# EasyEDA Pro project goobeywoobey.epro

# Schematic Schematic1
Board Name: Board1; Create Date: 2026-07-05; Page Name: P1; Project Name: falloutgpu; Schematic Name: Schematic1; Update Date: 2026-07-05; Company: EasyEDA.com; Page Size: A4; Version: V1.0
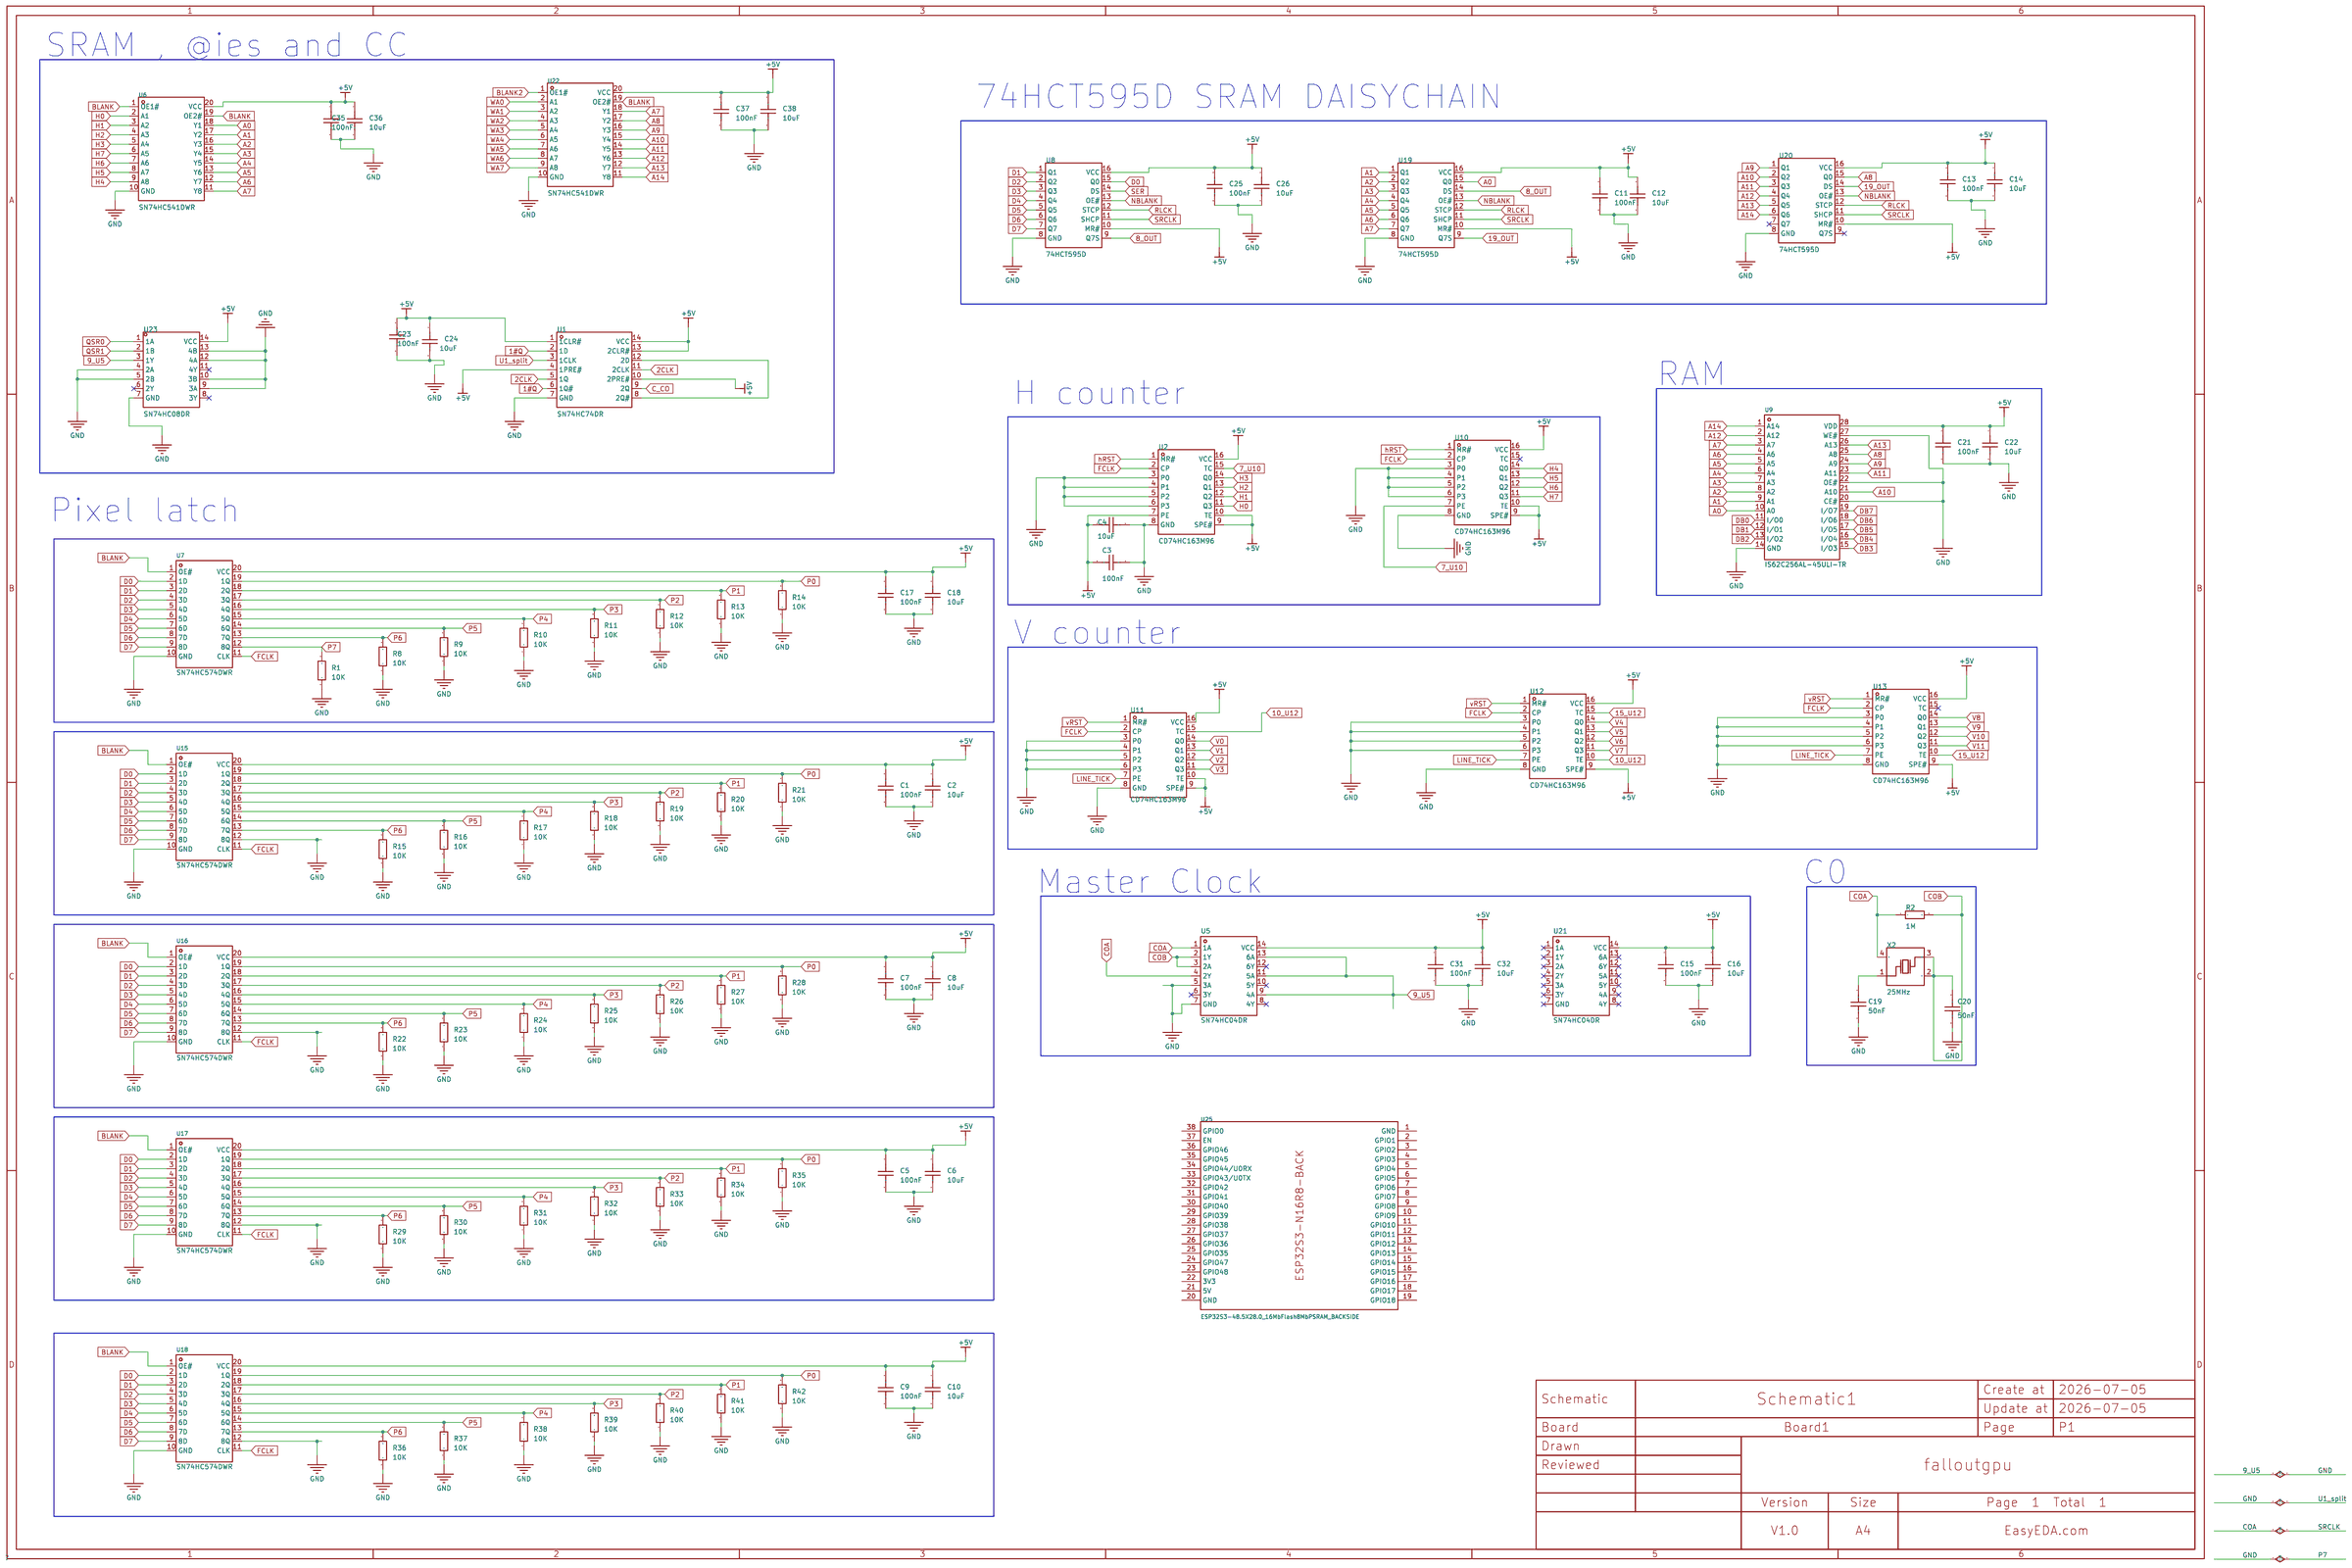
[diagram p0: schematic sheet]

## Parts
C1  100nF  [C0201]
C2  10uF  [C0201]
C3  100nF  [C0201]
C4  10uF  [C0201]
C5  100nF  [C0201]
C6  10uF  [C0201]
C7  100nF  [C0201]
C8  10uF  [C0201]
C9  100nF  [C0201]
C10  10uF  [C0201]
C11  100nF  [C0201]
C12  10uF  [C0201]
C13  100nF  [C0201]
C14  10uF  [C0201]
C15  100nF  [C0201]
C16  10uF  [C0201]
C17  100nF  [C0201]
C18  10uF  [C0201]
C19  50nF  [C0201]
C20  50nF  [C0201]
C21  100nF  [C0201]
C22  10uF  [C0201]
C23  100nF  [C0201]
C24  10uF  [C0201]
C25  100nF  [C0201]
C26  10uF  [C0201]
C31  100nF  [C0201]
C32  10uF  [C0201]
C35  100nF  [C0201]
C36  10uF  [C0201]
C37  100nF  [C0201]
C38  10uF  [C0201]
R1  10K  [R0603]
R2  1M  [R0603]
R8  10K  [R0603]
R9  10K  [R0603]
R10  10K  [R0603]
R11  10K  [R0603]
R12  10K  [R0603]
R13  10K  [R0603]
R14  10K  [R0603]
R15  10K  [R0603]
R16  10K  [R0603]
R17  10K  [R0603]
R18  10K  [R0603]
R19  10K  [R0603]
R20  10K  [R0603]
R21  10K  [R0603]
R22  10K  [R0603]
R23  10K  [R0603]
R24  10K  [R0603]
R25  10K  [R0603]
R26  10K  [R0603]
R27  10K  [R0603]
R28  10K  [R0603]
R29  10K  [R0603]
R30  10K  [R0603]
R31  10K  [R0603]
R32  10K  [R0603]
R33  10K  [R0603]
R34  10K  [R0603]
R35  10K  [R0603]
R36  10K  [R0603]
R37  10K  [R0603]
R38  10K  [R0603]
R39  10K  [R0603]
R40  10K  [R0603]
R41  10K  [R0603]
R42  10K  [R0603]
U1  SN74HC74DR  [SOIC-14_L8.7-W3.9-P1.27-LS6.0-BL]
U2  CD74HC163M96  [SOIC-16_L9.9-W3.9-P1.27-LS6.0-BL]
U5  SN74HC04DR  [SOIC-14_L8.7-W3.9-P1.27-LS6.0-BL]
U6  SN74HC541DWR  [SOIC-20_L13.0-W7.6-P1.27-LS10.3-BL]
U7  SN74HC574DWR  [SOIC-20_L13.0-W7.6-P1.27-LS10.3-BL]
U8  74HCT595D  [SOP-16_L9.9-W3.9-P1.27-LS6.0-BL]
U9  IS62C256AL-45ULI-TR  [SOIC-28_L17.9-W8.4-P1.27-LS12.7-BL]
U10  CD74HC163M96  [SOIC-16_L9.9-W3.9-P1.27-LS6.0-BL]
U11  CD74HC163M96  [SOIC-16_L9.9-W3.9-P1.27-LS6.0-BL]
U12  CD74HC163M96  [SOIC-16_L9.9-W3.9-P1.27-LS6.0-BL]
U13  CD74HC163M96  [SOIC-16_L9.9-W3.9-P1.27-LS6.0-BL]
U15  SN74HC574DWR  [SOIC-20_L13.0-W7.6-P1.27-LS10.3-BL]
U16  SN74HC574DWR  [SOIC-20_L13.0-W7.6-P1.27-LS10.3-BL]
U17  SN74HC574DWR  [SOIC-20_L13.0-W7.6-P1.27-LS10.3-BL]
U18  SN74HC574DWR  [SOIC-20_L13.0-W7.6-P1.27-LS10.3-BL]
U19  74HCT595D  [SOP-16_L9.9-W3.9-P1.27-LS6.0-BL]
U20  74HCT595D  [SOP-16_L9.9-W3.9-P1.27-LS6.0-BL]
U21  SN74HC04DR  [SOIC-14_L8.7-W3.9-P1.27-LS6.0-BL]
U22  SN74HC541DWR  [SOIC-20_L13.0-W7.6-P1.27-LS10.3-BL]
U23  SN74HC08DR  [SOIC-14_L8.7-W3.9-P1.27-LS6.0-BL]
U25  ESP32S3-48.5X28.0_16MbFlash8MbPSRAM_BACKSIDE  [ESP32S3-N16R8-BACKSIDE]
X2  25MHz  [CRYSTAL-SMD_4P-L3.2-W2.5-BL-2]

## Library data of the parts
C1-C26 C31 C32 C35-C38 = CAP_0201: Supplier Footprint: 0201
R1 R2 R8-R42 = Res_0603: Supplier Footprint: 0603
U1 = SN74HC74DR: Type:D-Type Trigger Type:Rising Edge Voltage - Supply:2V~6V Voltage - Supply:2V~6V Clock Frequency:60MHz Function:Set and Reset Number of Elements:2 Number of Bits per Element:1 Output Type:Complementary Propagation Delay:15ns@6V,50pF Series:74HC Series C; LCSC Part Name: 双D型正边沿触发触发器，带清零和预置功能，工作电压范围2V至6V; Supplier Part: C6762; Manufacturer: TI(德州仪器); Supplier Footprint: SOIC-14; JLCPCB Part Class: Extended Part; Datasheet: https://www.ti.com/cn/lit/gpn/sn74hc74; Supplier: LCSC; Type: D-Type; Trigger Type: Rising Edge; Voltage - Supply: 2V~6V; Clock Frequency: 60MHz; Function: Set and Reset; Number of Elements: 2; Number of Bits per Element: 1; Output Type: Complementary; Propagation Delay: 15ns@6V,50pF; Series: 74HC Series; Current - Output Low(IOL): 5.2mA; Current - Output High(IOH): 5.2mA; Quiescent Current: 4uA; Input Capacitance: 3pF; Operating Temperature: -40℃~+85℃; Synchronous/Asynchronous: Asynchronous; Setup Time: 25ns; Hold Time: 0ns
U2 U10-U13 = CD74HC163M96: Logic Type:Divide-by-2 Direction:- Voltage - Supply:2V~6V Voltage - Supply:2V~6V Number of Elements:1 Trigger Type:Falling Edge Reset:Synchronous Timing:Synchronous Count Rate:24MHz Operating Temperature:-55℃~+125℃ Operating Temperature:-55℃~+125℃ Number; LCSC Part Name: 24MHz 4位二进制计数器; Supplier Part: C1879801; Manufacturer: TI(德州仪器); Supplier Footprint: SOIC-16; JLCPCB Part Class: Extended Part; Datasheet: https://www.ti.com/cn/lit/gpn/cd74hc161; Supplier: LCSC; Logic Type: Divide-by-2; Voltage - Supply: 2V~6V; Number of Elements: 1; Trigger Type: Falling Edge; Reset: Synchronous; Timing: Synchronous; Count Rate: 24MHz; Operating Temperature: -55℃~+125℃; Features: Synchronous counting；Reset function；Cascade counter
U5 U21 = SN74HC04DR: Voltage - Supply:2V~6V Voltage - Supply:2V~6V Current - Supply:2uA Number of Circuits:6 Number of Inputs:1 Current - Output Low(IOL):5.2mA Current - Output High(IOH):5.2mA Input Logic Level - High:1.5V~4.2V Input Logic Level - High:1.5V~4.2V Input Logic L; Supplier Part: C6811; Manufacturer: TI(德州仪器); Supplier Footprint: SOIC-14; JLCPCB Part Class: Extended Part; Datasheet: https://www.ti.com/cn/lit/gpn/sn74hc04; Supplier: LCSC; Voltage - Supply: 2V~6V; Current - Supply: 2uA; Number of Circuits: 6; Number of Inputs: 1; Current - Output Low(IOL): 5.2mA; Current - Output High(IOH): 5.2mA; Input Logic Level - High: 1.5V~4.2V; Input Logic Level -Low: 500mV~1.8V; Max Propagation Delay: 16ns@6V,50pF; Series: 74HCSeries; Operating Temperature: -40℃~+85℃
U6 U22 = SN74HC541DWR: Input type:- output type:Tri-State Voltage - Supply:2V~6V Voltage - Supply:2V~6V Number of Elements:- Number of Bits per Element:8 Channel Type:- Current - Output Low(IOL):7.8mA Current - Output High(IOH):7.8mA Logic Family:74HC Operating Temperature:-40℃; Supplier Part: C6757; Manufacturer: TI(德州仪器); Supplier Footprint: SOIC-20-300mil; JLCPCB Part Class: Extended Part; Datasheet: https://www.ti.com/cn/lit/gpn/sn74hc541; Supplier: LCSC; output type: Tri-State; Voltage - Supply: 2V~6V; Number of Bits per Element: 8; Current - Output Low(IOL): 7.8mA; Current - Output High(IOH): 7.8mA; Logic Family: 74HC; Operating Temperature: -40℃~+85℃; Quiescent Current: 80uA; Propagation Delay: 23ns@4.5V,50pF
U7 U15-U18 = SN74HC574DWR: Type:D-Type Trigger Type:Rising Edge Voltage - Supply:2V~6V Voltage - Supply:2V~6V Clock Frequency:36MHz Function:- Output Type:- Propagation Delay:46ns@6V,150pF Series:74HCSeries Current - Output Low(IOL):7.8mA Current - Output High(IOH):7.8mA Quiescent; Supplier Part: C10097; Manufacturer: TI(德州仪器); Supplier Footprint: SOIC-20-300mil; JLCPCB Part Class: Extended Part; Datasheet: https://www.ti.com/cn/lit/gpn/sn74hc574; Supplier: LCSC; Type: D-Type; Trigger Type: Rising Edge; Voltage - Supply: 2V~6V; Clock Frequency: 36MHz; Propagation Delay: 46ns@6V,150pF; Series: 74HCSeries; Current - Output Low(IOL): 7.8mA; Current - Output High(IOH): 7.8mA; Quiescent Current: 8uA; Input Capacitance: 3pF
U8 U19 U20 = 74HCT595D: Function:Serial-to-Serial or Parallel Voltage - Supply:2.7V~5.5V Voltage - Supply:2.7V~5.5V Clock Frequency:24MHz Number of Elements:- Number of Bits per Element:- Output Type:Tri-State Series:74HCT Operating Temperature:-40℃~+125℃ Operating Temperature:-; Supplier Part: C52140404; Manufacturer: MDD(辰达半导体); Supplier Footprint: SOP-16L; JLCPCB Part Class: Extended Part; Datasheet: https://item.szlcsc.com/datasheet/74HCT595D/54938133.html; Supplier: LCSC; Function: Serial-to-Serial or Parallel; Voltage - Supply: 2.7V~5.5V; Clock Frequency: 24MHz; Output Type: Tri-State; Series: 74HCT; Operating Temperature: -40℃~+125℃; Pd - Power Dissipation: 500mW; Propagation Delay: 30ns@4.5V,15pF; Output Current: 35mA; Features: Asynchronous clear function；Output enable
U9 = IS62C256AL-45ULI-TR: Memory Size:256Kbit Voltage - Supply:4.5V~5.5V Voltage - Supply:4.5V~5.5V Access Time:45ns Operating Temperature:-40℃~+85℃ Operating Temperature:-40℃~+85℃ Standby Current (Iq):20uA; LCSC Part Name: 32K x 8低功耗CMOS静态RAM; Supplier Part: C14323; Manufacturer: ISSI(美国芯成); Supplier Footprint: SOIC-28-8.4mm; JLCPCB Part Class: Extended Part; Datasheet: https://item.szlcsc.com/datasheet/IS62C256AL-45ULI-TR/14983.html; Supplier: LCSC; Memory Size: 256Kbit; Voltage - Supply: 4.5V~5.5V; Access Time: 45ns; Operating Temperature: -40℃~+85℃; Standby Current (Iq): 20uA
U23 = SN74HC08DR: Logic Type:AND Gate Number of Channels:4 Voltage - Supply:2V~6V Voltage - Supply:2V~6V Quiescent Current:2uA Current - Output Low(IOL):5.2mA Current - Output High(IOH):5.2mA Input Logic Level - High:1.5V~4.2V Input Logic Level - High:1.5V~4.2V Input Logic; LCSC Part Name: 四组 2 输入正与门; Supplier Part: C337768; Manufacturer: TI(德州仪器); Supplier Footprint: SOIC-14; JLCPCB Part Class: Extended Part; Datasheet: https://www.ti.com/cn/lit/ds/symlink/sn74hc08.pdf; Supplier: LCSC; Logic Type: AND Gate; Number of Channels: 4; Voltage - Supply: 2V~6V; Quiescent Current: 2uA; Current - Output Low(IOL): 5.2mA; Current - Output High(IOH): 5.2mA; Input Logic Level - High: 1.5V~4.2V; Input Logic Level - Low: 500mV~1.8V; Output Logic Level - High: 1.9V；5.48V；3.98V; Output Logic Level - Low: 100mV；260mV；260mV; Series: 74HC Series; Propagation Delay: 17ns@6V,50pF; Operating Temperature: -40℃~+85℃; Input Number: 2
U25 = ESP32S3-48.5X28.0_16MbFlash8MbPSRAM_BACKSIDE: ESP32S3-48.5X28.0_16MbFlash8MbPSRAM
X2 = X322525MSB4SI: Type:Crystal Oscillator Frequency:25MHz Normal temperature Frequency Tolerance:±10ppm Normal temperature Frequency Tolerance:±10ppm Load Capacitance:20pF Frequency Stability:±20ppm Frequency Stability:±20ppm Operating Temperature:-40℃~+85℃ Operating Tempe; LCSC Part Name: YSX321SL 25MHZ 4P 3225 20PF ±10PPM -40~85℃ (±20PPM); Supplier Part: C13740; Manufacturer: YXC(扬兴晶振); Supplier Footprint: SMD3225-4P; JLCPCB Part Class: Extended Part; Datasheet: https://item.szlcsc.com/datasheet/X322525MSB4SI/14395.html; Supplier: LCSC; Type: Crystal Oscillator; Normal temperature Frequency Tolerance: ±10ppm; Load Capacitance: 20pF; Frequency Stability: ±20ppm; Operating Temperature: -40℃~+85℃

## Nets
+5V: C1.1 C2.1 C3.1 C4.1 C5.1 C6.1 C7.1 C8.1 C9.1 C10.1 C11.1 C12.1 C13.1 C14.1 C15.1 C16.1 C17.1 C18.1 C21.1 C22.1 C23.1 C24.1 C25.1 C26.1 C31.1 C32.1 C35.1 C36.1 C37.1 C38.1 U1.1(1CLR#) U1.4(1PRE#) U1.10(2PRE#) U1.13(2CLR#) U1.14(VCC) U2.7(PE) U2.9(SPE#) U2.10(TE) U2.16(VCC) U5.14(VCC) U6.20(VCC) U7.20(VCC) U8.10(MR#) U8.16(VCC) U9.28(VDD) U10.9(SPE#) U10.10(TE) U10.16(VCC) U11.9(SPE#) U11.10(TE) U11.16(VCC) U12.9(SPE#) U12.16(VCC) U13.9(SPE#) U13.16(VCC) U15.20(VCC) U16.20(VCC) U17.20(VCC) U18.20(VCC) U19.10(MR#) U19.16(VCC) U20.10(MR#) U20.16(VCC) U21.14(VCC) U22.20(VCC) U23.14(VCC)
GND: C1.2 C2.2 C3.2 C4.2 C5.2 C6.2 C7.2 C8.2 C9.2 C10.2 C11.2 C12.2 C13.2 C14.2 C15.2 C16.2 C17.2 C18.2 C19.2 C20.2 C21.2 C22.2 C23.2 C24.2 C25.2 C26.2 C31.2 C32.2 C35.2 C36.2 C37.2 C38.2 R1.1 R1.2 R8.1 R9.1 R10.1 R11.1 R12.1 R13.1 R14.1 R15.1 R16.1 R17.1 R18.1 R19.1 R20.1 R21.1 R22.1 R23.1 R24.1 R25.1 R26.1 R27.1 R28.1 R29.1 R30.1 R31.1 R32.1 R33.1 R34.1 R35.1 R36.1 R37.1 R38.1 R39.1 R40.1 R41.1 R42.1 U1.3(1CLK) U1.7(GND) U2.3(P0) U2.4(P1) U2.5(P2) U2.6(P3) U2.8(GND) U5.5(3A) U5.7(GND) U5.9(4A) U5.11(5A) U5.13(6A) U6.10(GND) U7.10(GND) U7.12(8Q) U8.8(GND) U9.14(GND) U9.20(CE#) U9.22(OE#) U9.27(WE#) U10.3(P0) U10.4(P1) U10.5(P2) U10.6(P3) U10.8(GND) U11.3(P0) U11.4(P1) U11.5(P2) U11.6(P3) U11.8(GND) U12.3(P0) U12.4(P1) U12.5(P2) U12.6(P3) U12.8(GND) U13.3(P0) U13.4(P1) U13.5(P2) U13.6(P3) U13.8(GND) U15.10(GND) U15.12(8Q) U16.10(GND) U16.12(8Q) U17.10(GND) U17.12(8Q) U18.10(GND) U18.12(8Q) U19.8(GND) U20.8(GND) U22.10(GND) U23.3(1Y) U23.4(2A) U23.5(2B) U23.7(GND) U23.9(3A) U23.10(3B) U23.12(4A) U23.13(4B)
V0: U11.14(Q0)
V1: U11.13(Q1)
V2: U11.12(Q2)
V3: U11.11(Q3)
V4: U12.14(Q0)
V5: U12.13(Q1)
V6: U12.12(Q2)
V7: U12.11(Q3)
V8: U13.14(Q0)
V9: U13.13(Q1)
V10: U13.12(Q2)
V11: U13.11(Q3)
1#Q: U1.2(1D) U1.6(1Q#)
2CLK: U1.5(1Q) U1.11(2CLK)
7_U10: U2.15(TC) U10.7(PE)
8_OUT: U8.9(Q7S) U19.14(DS)
10_U12: U11.15(TC) U12.10(TE)
15_U12: U12.15(TC) U13.10(TE)
19_OUT: U19.9(Q7S) U20.14(DS)
A0: U6.18(Y1) U9.10(A0) U19.15(Q0)
A1: U6.17(Y2) U9.9(A1) U19.1(Q1)
A2: U6.16(Y3) U9.8(A2) U19.2(Q2)
A3: U6.15(Y4) U9.7(A3) U19.3(Q3)
A4: U6.14(Y5) U9.6(A4) U19.4(Q4)
A5: U6.13(Y6) U9.5(A5) U19.5(Q5)
A6: U6.12(Y7) U9.4(A6) U19.6(Q6)
A7: U6.11(Y8) U9.3(A7) U19.7(Q7) U22.18(Y1)
A8: U9.25(A8) U20.15(Q0) U22.17(Y2)
A9: U9.24(A9) U20.1(Q1) U22.16(Y3)
A10: U9.21(A10) U20.2(Q2) U22.15(Y4)
A11: U9.23(A11) U20.3(Q3) U22.14(Y5)
A12: U9.2(A12) U20.4(Q4) U22.13(Y6)
A13: U9.26(A13) U20.5(Q5) U22.12(Y7)
A14: U9.1(A14) U20.6(Q6) U22.11(Y8)
BLANK: U6.1(OE1#) U6.19(OE2#) U7.1(OE#) U15.1(OE#) U16.1(OE#) U17.1(OE#) U18.1(OE#) U22.19(OE2#)
BLANK2: U22.1(OE1#)
C_CO: U1.9(2Q)
COA: R2.1 U5.1(1A) U5.4(2Y) U8.11(SHCP) U19.11(SHCP) U20.11(SHCP) X2.4(GND)
COB: C20.1 R2.2 U5.2(1Y) U5.3(2A) X2.2(GND) X2.3(OSC2)
D0: U7.2(1D) U8.15(Q0) U15.2(1D) U16.2(1D) U17.2(1D) U18.2(1D)
D1: U7.3(2D) U8.1(Q1) U15.3(2D) U16.3(2D) U17.3(2D) U18.3(2D)
D2: U7.4(3D) U8.2(Q2) U15.4(3D) U16.4(3D) U17.4(3D) U18.4(3D)
D3: U7.5(4D) U8.3(Q3) U15.5(4D) U16.5(4D) U17.5(4D) U18.5(4D)
D4: U7.6(5D) U8.4(Q4) U15.6(5D) U16.6(5D) U17.6(5D) U18.6(5D)
D5: U7.7(6D) U8.5(Q5) U15.7(6D) U16.7(6D) U17.7(6D) U18.7(6D)
D6: U7.8(7D) U8.6(Q6) U15.8(7D) U16.8(7D) U17.8(7D) U18.8(7D)
D7: U7.9(8D) U8.7(Q7) U15.9(8D) U16.9(8D) U17.9(8D) U18.9(8D)
DB0: U9.11(I/O0)
DB1: U9.12(I/O1)
DB2: U9.13(I/O2)
DB3: U9.15(I/O3)
DB4: U9.16(I/O4)
DB5: U9.17(I/O5)
DB6: U9.18(I/O6)
DB7: U9.19(I/O7)
FCLK: U2.2(CP) U7.11(CLK) U10.2(CP) U11.2(CP) U12.2(CP) U13.2(CP) U15.11(CLK) U16.11(CLK) U17.11(CLK) U18.11(CLK)
H0: U2.11(Q3) U6.2(A1)
H1: U2.12(Q2) U6.3(A2)
H2: U2.13(Q1) U6.4(A3)
H3: U2.14(Q0) U6.5(A4)
H4: U6.9(A8) U10.14(Q0)
H5: U6.8(A7) U10.13(Q1)
H6: U6.7(A6) U10.12(Q2)
H7: U6.6(A5) U10.11(Q3)
hRST: U2.1(MR#) U10.1(MR#)
LINE_TICK: U11.7(PE) U12.7(PE) U13.7(PE)
NBLANK: U8.13(OE#) U19.13(OE#) U20.13(OE#)
P0: R14.2 R21.2 R28.2 R35.2 R42.2 U7.19(1Q) U15.19(1Q) U16.19(1Q) U17.19(1Q) U18.19(1Q)
P1: R13.2 R20.2 R27.2 R34.2 R41.2 U7.18(2Q) U15.18(2Q) U16.18(2Q) U17.18(2Q) U18.18(2Q)
P2: R12.2 R19.2 R26.2 R33.2 R40.2 U7.17(3Q) U15.17(3Q) U16.17(3Q) U17.17(3Q) U18.17(3Q)
P3: R11.2 R18.2 R25.2 R32.2 R39.2 U7.16(4Q) U15.16(4Q) U16.16(4Q) U17.16(4Q) U18.16(4Q)
P4: R10.2 R17.2 R24.2 R31.2 R38.2 U7.15(5Q) U15.15(5Q) U16.15(5Q) U17.15(5Q) U18.15(5Q)
P5: R9.2 R16.2 R23.2 R30.2 R37.2 U7.14(6Q) U15.14(6Q) U16.14(6Q) U17.14(6Q) U18.14(6Q)
P6: R8.2 R15.2 R22.2 R29.2 R36.2 U7.13(7Q) U15.13(7Q) U16.13(7Q) U17.13(7Q) U18.13(7Q)
QSR0: U23.1(1A)
QSR1: U23.2(1B)
RLCK: U8.12(STCP) U19.12(STCP) U20.12(STCP)
SER: U8.14(DS)
vRST: U11.1(MR#) U12.1(MR#) U13.1(MR#)
WA0: U22.2(A1)
WA1: U22.3(A2)
WA2: U22.4(A3)
WA3: U22.5(A4)
WA4: U22.6(A5)
WA5: U22.7(A6)
WA6: U22.8(A7)
WA7: U22.9(A8)
$1N287: C19.1 X2.1(OSC1)
$1N421: U1.8(2Q#) U1.12(2D)

Not connected (* = marked no-connect by the designer): U5 6(3Y)* 8(4Y)* 10(5Y)* 12(6Y)*; U10 15(TC)*; U13 15(TC)*; U20 7(Q7)* 9(Q7S)*; U21 1(1A)* 2(1Y)* 3(2A)* 4(2Y)* 5(3A)* 6(3Y)* 7(GND)* 8(4Y)* 9(4A)* 10(5Y)* 11(5A)* 12(6Y)* 13(6A)*; U23 6(2Y)* 8(3Y)* 11(4Y)*; U25 1(GND) 2(GPIO1) 3(GPIO2) 4(GPIO3) 5(GPIO4) 6(GPIO5) 7(GPIO6) 8(GPIO7) 9(GPIO8) 10(GPIO9) 11(GPIO10) 12(GPIO11) 13(GPIO12) 14(GPIO13) 15(GPIO14) 16(GPIO15) 17(GPIO16) 18(GPIO17) 19(GPIO18) 20(GND) 21(5V) 22(3V3) 23(GPIO48) 24(GPIO47) 25(GPIO35) 26(GPIO36) 27(GPIO37) 28(GPIO38) 29(GPIO39) 30(GPIO40) 31(GPIO41) 32(GPIO42) 33(GPIO43/U0TX) 34(GPIO44/U0RX) 35(GPIO45) 36(GPIO46) 37(EN) 38(GPIO0)

## Notes on the sheet
- SRAM , @ies and CC
- 74HCT595D SRAM DAISYCHAIN
- RAM
- H counter
- Pixel latch
- V counter
- Master Clock
- C0

# Board PCB1
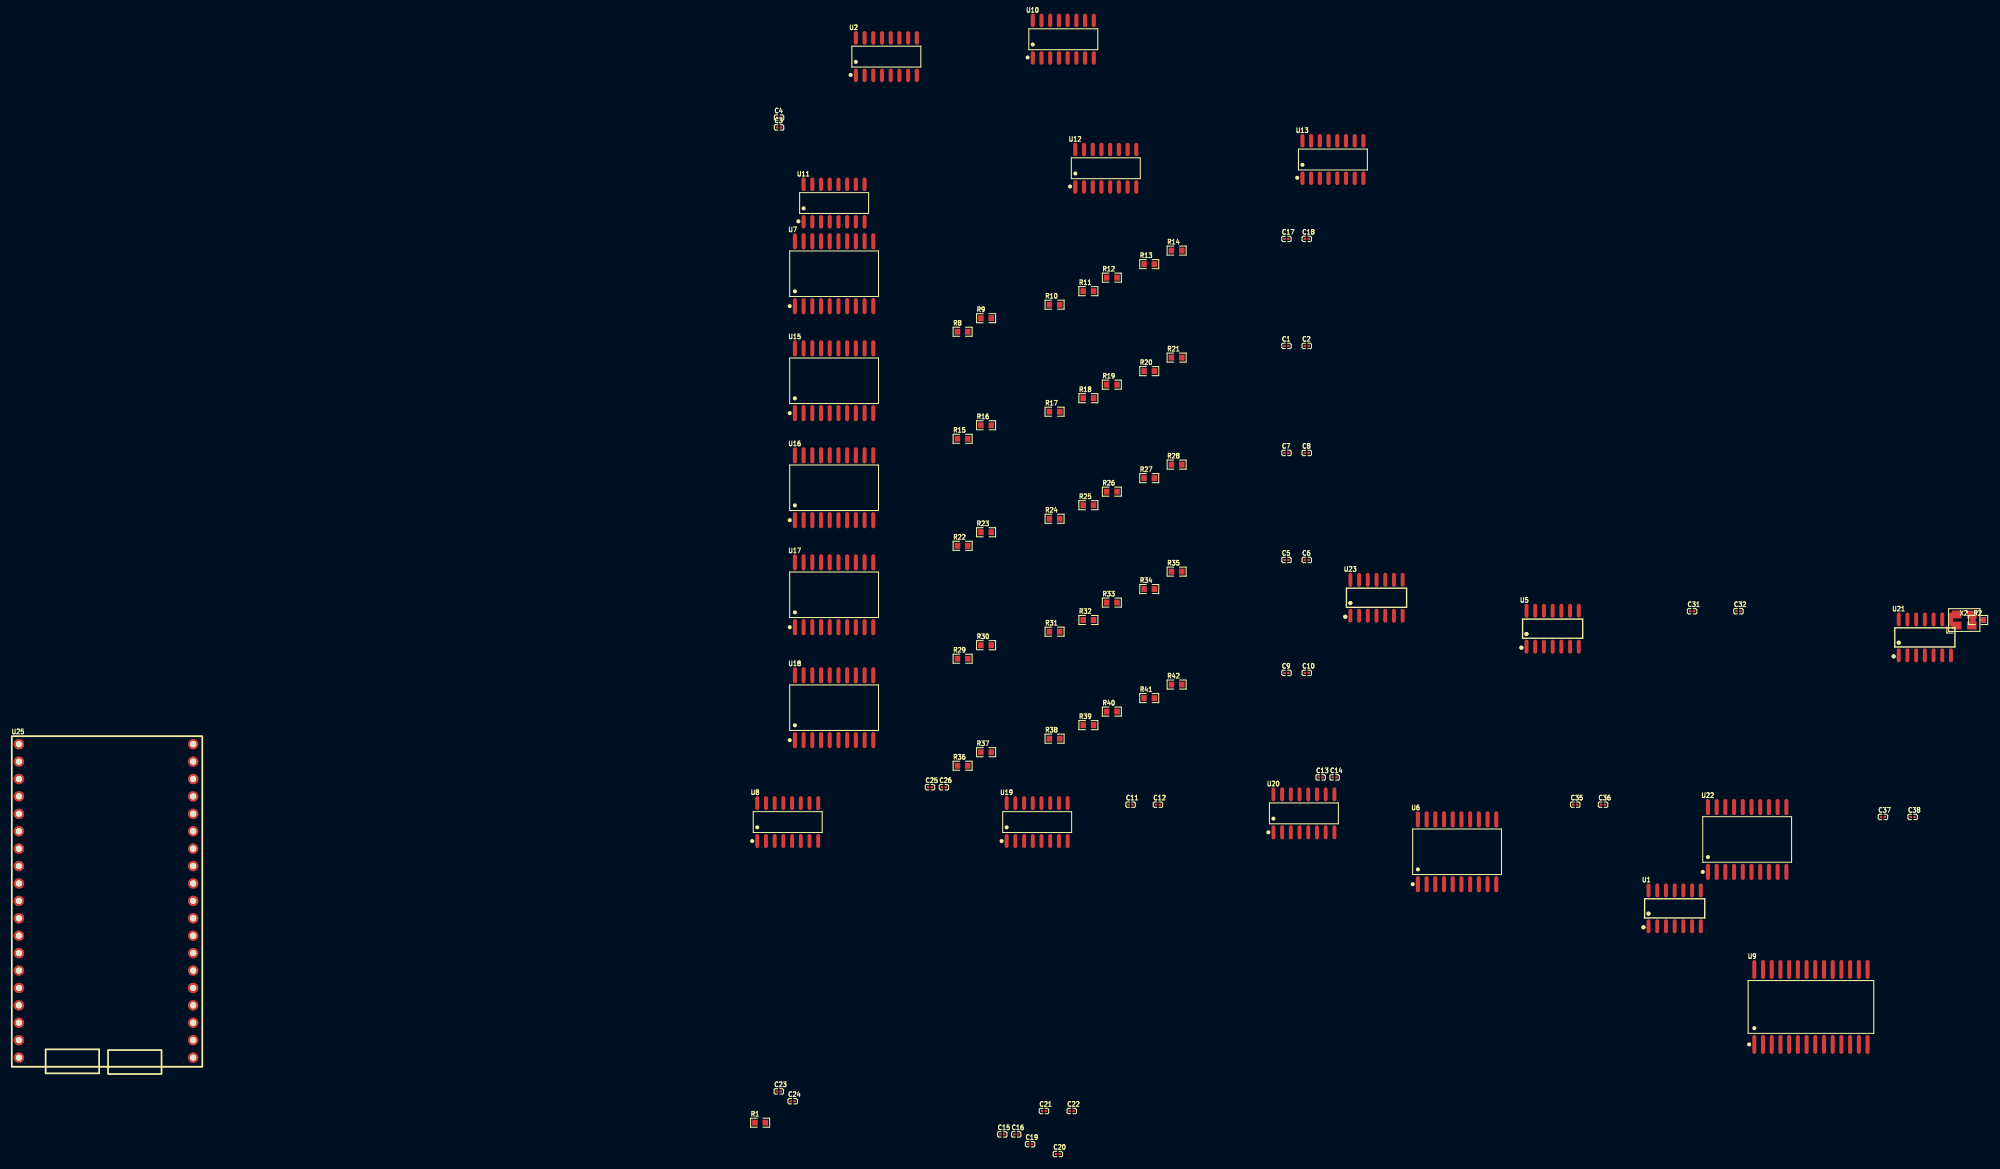
[diagram p1: board, top side]
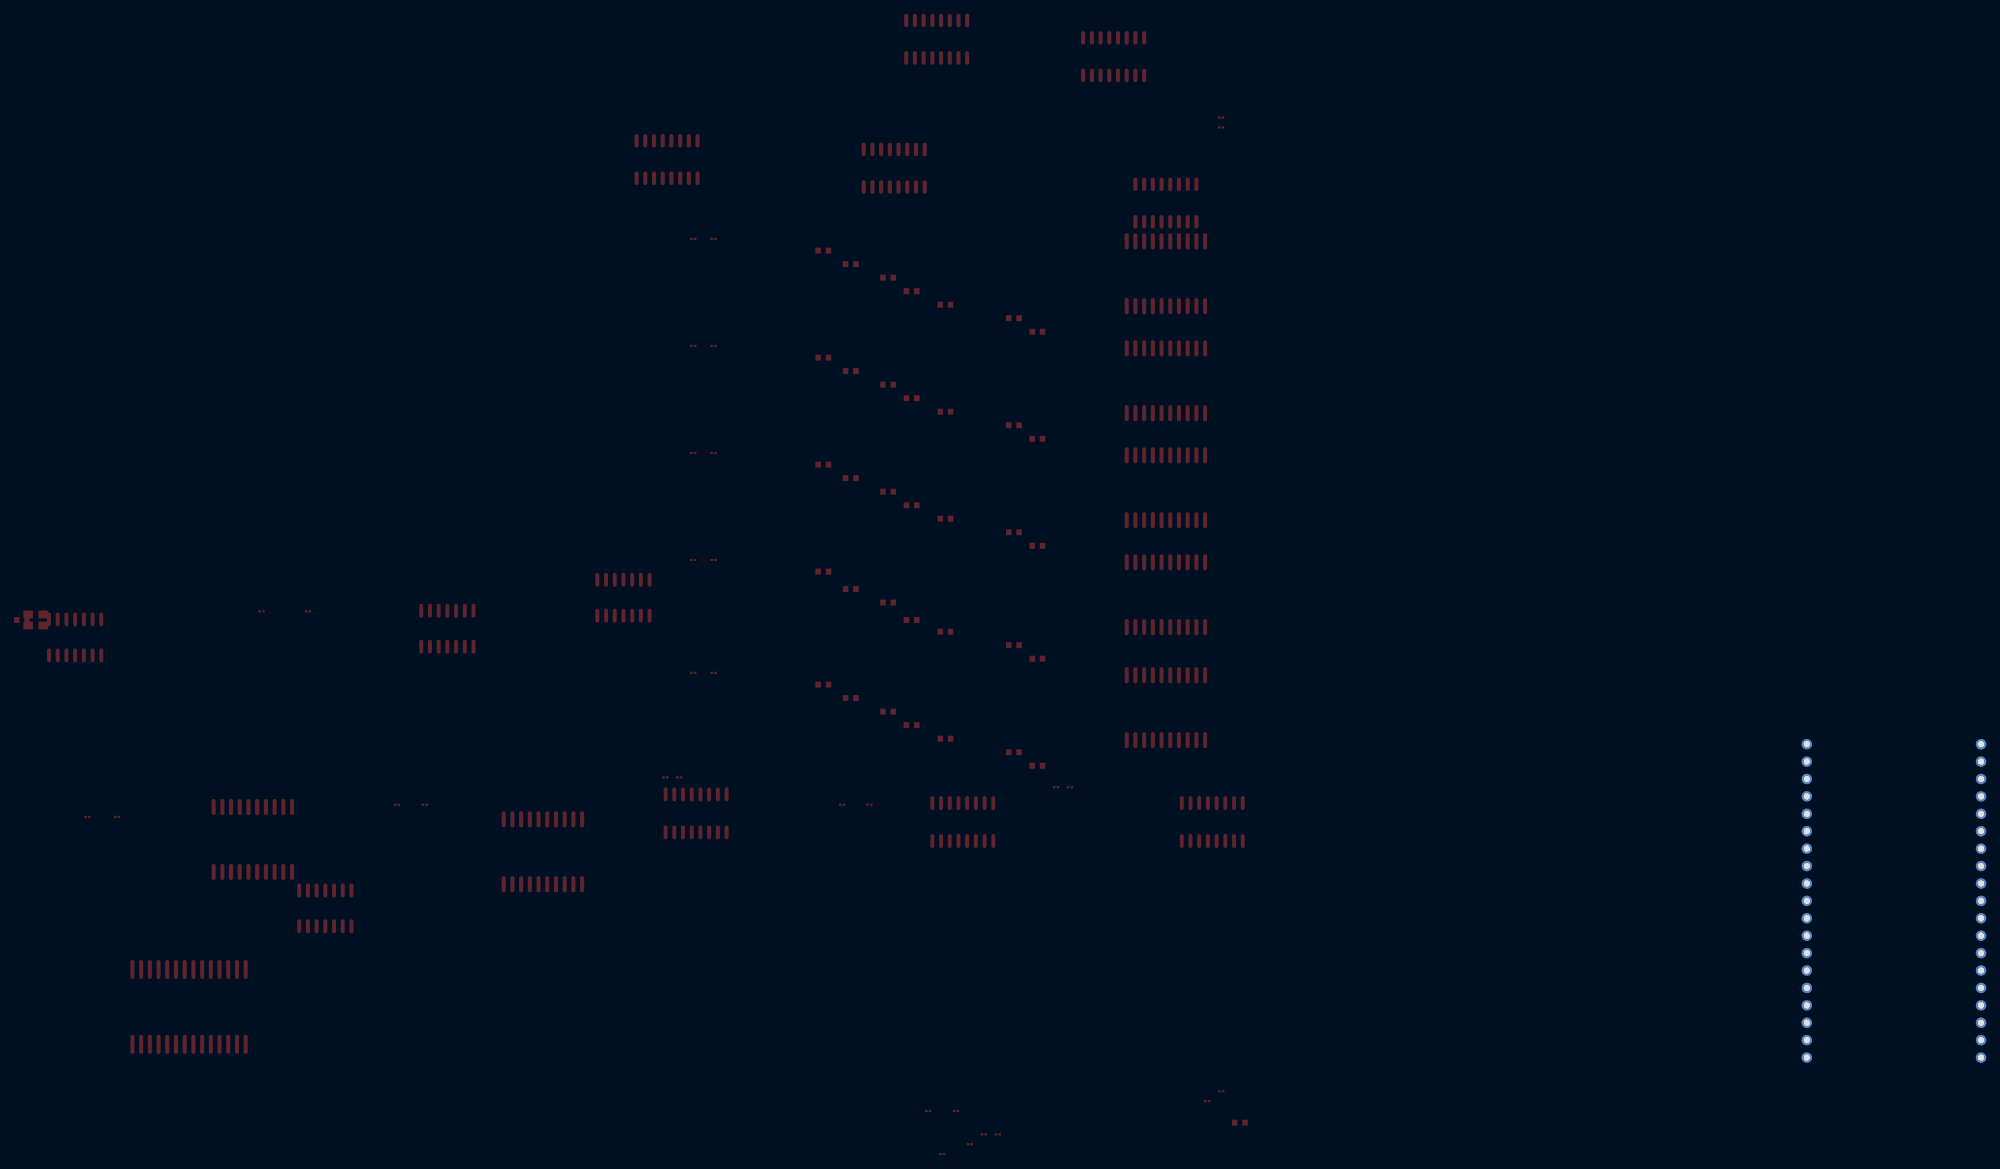
[diagram p2: board, bottom side, seen from below]

No outline. copper layers: Top Layer, Bottom Layer. Coordinates in mm from the lowest, leftmost part position.
Stack: Top Layer 0.035mm / Dielectric1 1.51mm FR4 er 4.5 / Bottom Layer 0.035mm

## Design rules (mm)
spacing copperThickness1oz (default): track to track 0.102, other pairs 0.152 to 0.3
spacing copperThickness2oz: track to track 0.203, other pairs 0.152 to 0.3
track width copperThickness1oz (default): min 0.127, default 0.254, max 2.54
track width copperThickness2oz: min 0.203, default 0.254, max 2.54
differential pair differentialPair (default): width min 0.127, default 0.254, max 2.54; gap min 0.152, default 0.152

## Placement (name value [footprint] x y rotation side)
C1  100nF  [C0201]  172.3 117.89 0 top
C2  10uF  [C0201]  175.26 117.89 0 top
C3  100nF  [C0201]  98.32 149.77 0 top
C4  10uF  [C0201]  98.32 151.2 0 top
C5  100nF  [C0201]  172.3 86.67 0 top
C6  10uF  [C0201]  175.26 86.67 0 top
C7  100nF  [C0201]  172.3 102.28 0 top
C8  10uF  [C0201]  175.26 102.28 0 top
C9  100nF  [C0201]  172.3 70.19 0 top
C10  10uF  [C0201]  175.26 70.19 0 top
C11  100nF  [C0201]  149.57 50.97 0 top
C12  10uF  [C0201]  153.56 50.97 0 top
C13  100nF  [C0201]  177.29 54.94 0 top
C14  10uF  [C0201]  179.32 54.94 0 top
C15  100nF  [C0201]  130.87 2.87 0 top
C16  10uF  [C0201]  132.9 2.87 0 top
C17  100nF  [C0201]  172.3 133.5 0 top
C18  10uF  [C0201]  175.26 133.5 0 top
C19  50nF  [C0201]  134.92 1.43 0 top
C20  50nF  [C0201]  138.98 0 0 top
C21  100nF  [C0201]  136.95 6.27 0 top
C22  10uF  [C0201]  141 6.27 0 top
C23  100nF  [C0201]  98.29 9.14 0 top
C24  10uF  [C0201]  100.32 7.71 0 top
C25  100nF  [C0201]  120.34 53.51 0 top
C26  10uF  [C0201]  122.36 53.51 0 top
C31  100nF  [C0201]  231.44 79.18 0 top
C32  10uF  [C0201]  238.2 79.18 0 top
C35  100nF  [C0201]  214.4 50.97 0 top
C36  10uF  [C0201]  218.46 50.97 0 top
C37  100nF  [C0201]  259.26 49.17 0 top
C38  10uF  [C0201]  263.59 49.17 0 top
R1  10K  [R0603]  95.57 4.57 0 top
R2  1M  [R0603]  273.14 77.91 0 top
R8  10K  [R0603]  125.09 119.96 0 top
R9  10K  [R0603]  128.51 121.93 0 top
R10  10K  [R0603]  138.49 123.9 0 top
R11  10K  [R0603]  143.42 125.88 0 top
R12  10K  [R0603]  146.85 127.85 0 top
R13  10K  [R0603]  152.29 129.82 0 top
R14  10K  [R0603]  156.29 131.8 0 top
R15  10K  [R0603]  125.09 104.34 0 top
R16  10K  [R0603]  128.51 106.32 0 top
R17  10K  [R0603]  138.49 108.29 0 top
R18  10K  [R0603]  143.42 110.27 0 top
R19  10K  [R0603]  146.85 112.24 0 top
R20  10K  [R0603]  152.29 114.21 0 top
R21  10K  [R0603]  156.29 116.19 0 top
R22  10K  [R0603]  125.09 88.73 0 top
R23  10K  [R0603]  128.51 90.71 0 top
R24  10K  [R0603]  138.49 92.68 0 top
R25  10K  [R0603]  143.42 94.65 0 top
R26  10K  [R0603]  146.85 96.63 0 top
R27  10K  [R0603]  152.29 98.6 0 top
R28  10K  [R0603]  156.29 100.57 0 top
R29  10K  [R0603]  125.09 72.26 0 top
R30  10K  [R0603]  128.51 74.23 0 top
R31  10K  [R0603]  138.49 76.2 0 top
R32  10K  [R0603]  143.42 77.91 0 top
R33  10K  [R0603]  146.85 80.45 0 top
R34  10K  [R0603]  152.29 82.42 0 top
R35  10K  [R0603]  156.29 84.96 0 top
R36  10K  [R0603]  125.09 56.65 0 top
R37  10K  [R0603]  128.51 58.62 0 top
R38  10K  [R0603]  138.49 60.59 0 top
R39  10K  [R0603]  143.42 62.57 0 top
R40  10K  [R0603]  146.85 64.54 0 top
R41  10K  [R0603]  152.29 66.51 0 top
R42  10K  [R0603]  156.29 68.49 0 top
U1  SN74HC74DR  [SOIC-14_L8.7-W3.9-P1.27-LS6.0-BL]  228.9 35.84 0 top
U2  CD74HC163M96  [SOIC-16_L9.9-W3.9-P1.27-LS6.0-BL]  113.97 160.09 0 top
U5  SN74HC04DR  [SOIC-14_L8.7-W3.9-P1.27-LS6.0-BL]  211.11 76.64 0 top
U6  SN74HC541DWR  [SOIC-20_L13.0-W7.6-P1.27-LS10.3-BL]  197.18 44.09 0 top
U7  SN74HC574DWR  [SOIC-20_L13.0-W7.6-P1.27-LS10.3-BL]  106.35 128.42 0 top
U8  74HCT595D  [SOP-16_L9.9-W3.9-P1.27-LS6.0-BL]  99.59 48.43 0 top
U9  IS62C256AL-45ULI-TR  [SOIC-28_L17.9-W8.4-P1.27-LS12.7-BL]  248.76 21.46 0 top
U10  CD74HC163M96  [SOIC-16_L9.9-W3.9-P1.27-LS6.0-BL]  139.76 162.63 0 top
U11  CD74HC163M96  [SOIC-16_L9.9-W3.9-P1.27-LS6.0-BL]  106.35 138.73 0 top
U12  CD74HC163M96  [SOIC-16_L9.9-W3.9-P1.27-LS6.0-BL]  145.96 143.81 0 top
U13  CD74HC163M96  [SOIC-16_L9.9-W3.9-P1.27-LS6.0-BL]  179.07 145.08 0 top
U15  SN74HC574DWR  [SOIC-20_L13.0-W7.6-P1.27-LS10.3-BL]  106.35 112.81 0 top
U16  SN74HC574DWR  [SOIC-20_L13.0-W7.6-P1.27-LS10.3-BL]  106.35 97.2 0 top
U17  SN74HC574DWR  [SOIC-20_L13.0-W7.6-P1.27-LS10.3-BL]  106.35 81.59 0 top
U18  SN74HC574DWR  [SOIC-20_L13.0-W7.6-P1.27-LS10.3-BL]  106.35 65.11 0 top
U19  74HCT595D  [SOP-16_L9.9-W3.9-P1.27-LS6.0-BL]  135.95 48.43 0 top
U20  74HCT595D  [SOP-16_L9.9-W3.9-P1.27-LS6.0-BL]  174.84 49.7 0 top
U21  SN74HC04DR  [SOIC-14_L8.7-W3.9-P1.27-LS6.0-BL]  265.37 75.37 0 top
U22  SN74HC541DWR  [SOIC-20_L13.0-W7.6-P1.27-LS10.3-BL]  239.47 45.89 0 top
U23  SN74HC08DR  [SOIC-14_L8.7-W3.9-P1.27-LS6.0-BL]  185.43 81.15 0 top
U25  ESP32S3-48.5X28.0_16MbFlash8MbPSRAM_BACKSIDE  [ESP32S3-N16R8-BACKSIDE]  0 37.37 0 top
X2  25MHz  [CRYSTAL-SMD_4P-L3.2-W2.5-BL-2]  271.12 77.91 0 top

## Footprints (pads in the part's own frame, mm; a bottom-side part is the same pattern mirrored in y, then rotated)
C0201
  rect 0.368x0.324 smd: 1(-0.275,0) 2(0.275,0)
CRYSTAL-SMD_4P-L3.2-W2.5-BL-2
  rect 1.4x1.15 smd: 1(-1.1,-0.8) 2(1.1,-0.8) 3(1.1,0.8) 4(-1.1,0.8)
ESP32S3-N16R8-BACKSIDE
  round 1.524 hole 0.914: 1(12.91,22.42) 2(12.91,19.88) 3(12.91,17.34) 4(12.91,14.8) 5(12.91,12.26) 6(12.91,9.72) 7(12.91,7.18) 8(12.91,4.64) 9(12.91,2.1) 10(12.91,-0.44) 11(12.91,-2.98) 12(12.91,-5.52) 13(12.91,-8.06) 14(12.91,-10.6) 15(12.91,-13.14) 16(12.91,-15.68) 17(12.91,-18.22) 18(12.91,-20.76) 19(12.91,-23.3) 20(-12.49,-23.3) 21(-12.49,-20.76) 22(-12.49,-18.22) 23(-12.49,-15.68) 24(-12.49,-13.14) 25(-12.49,-10.6) 26(-12.49,-8.06) 27(-12.49,-5.52) 28(-12.49,-2.98) 29(-12.49,-0.44) 30(-12.49,2.1) 31(-12.49,4.64) 32(-12.49,7.18) 33(-12.49,9.72) 34(-12.49,12.26) 35(-12.49,14.8) 36(-12.49,17.34) 37(-12.49,19.88) 38(-12.49,22.42)
R0603
  rect 0.806x0.864 smd: 1(-0.753,0) 2(0.753,0)
SOIC-14_L8.7-W3.9-P1.27-LS6.0-BL
  oval 0.574x2.038 smd: 1(-3.81,-2.619) 2(-2.54,-2.619) 3(-1.27,-2.619) 4(0,-2.619) 5(1.27,-2.619) 6(2.54,-2.619) 7(3.81,-2.619) 8(3.81,2.619) 9(2.54,2.619) 10(1.27,2.619) 11(0,2.619) 12(-1.27,2.619) 13(-2.54,2.619) 14(-3.81,2.619)
SOIC-16_L9.9-W3.9-P1.27-LS6.0-BL
  oval 0.602x1.971 smd: 1(-4.445,-2.736) 2(-3.175,-2.736) 3(-1.905,-2.736) 4(-0.635,-2.736) 5(0.635,-2.736) 6(1.905,-2.736) 7(3.175,-2.736) 8(4.445,-2.736) 9(4.445,2.736) 10(3.175,2.736) 11(1.905,2.736) 12(0.635,2.736) 13(-0.635,2.736) 14(-1.905,2.736) 15(-3.175,2.736) 16(-4.445,2.736)
SOIC-20_L13.0-W7.6-P1.27-LS10.3-BL
  oval 0.595x2.36 smd: 1(-5.715,-4.73) 2(-4.445,-4.73) 3(-3.175,-4.73) 4(-1.905,-4.73) 5(-0.635,-4.73) 6(0.635,-4.73) 7(1.905,-4.73) 8(3.175,-4.73) 9(4.445,-4.73) 10(5.715,-4.73) 11(5.715,4.73) 12(4.445,4.73) 13(3.175,4.73) 14(1.905,4.73) 15(0.635,4.73) 16(-0.635,4.73) 17(-1.905,4.73) 18(-3.175,4.73) 19(-4.445,4.73) 20(-5.715,4.73)
SOIC-28_L17.9-W8.4-P1.27-LS12.7-BL
  oval 0.595x2.766 smd: 1(-8.255,-5.465) 2(-6.985,-5.465) 3(-5.715,-5.465) 4(-4.445,-5.465) 5(-3.175,-5.465) 6(-1.905,-5.465) 7(-0.635,-5.465) 8(0.635,-5.465) 9(1.905,-5.465) 10(3.175,-5.465) 11(4.445,-5.465) 12(5.715,-5.465) 13(6.985,-5.465) 14(8.255,-5.465) 15(8.255,5.465) 16(6.985,5.465) 17(5.715,5.465) 18(4.445,5.465) 19(3.175,5.465) 20(1.905,5.465) 21(0.635,5.465) 22(-0.635,5.465) 23(-1.905,5.465) 24(-3.175,5.465) 25(-4.445,5.465) 26(-5.715,5.465) 27(-6.985,5.465) 28(-8.255,5.465)
SOP-16_L9.9-W3.9-P1.27-LS6.0-BL
  oval 0.574x2.038 smd: 1(-4.445,-2.769) 2(-3.175,-2.769) 3(-1.905,-2.769) 4(-0.635,-2.769) 5(0.635,-2.769) 6(1.905,-2.769) 7(3.175,-2.769) 8(4.445,-2.769) 9(4.445,2.769) 10(3.175,2.769) 11(1.905,2.769) 12(0.635,2.769) 13(-0.635,2.769) 14(-1.905,2.769) 15(-3.175,2.769) 16(-4.445,2.769)

## Nets
As in the schematic.

Pads without a net: U5 6 8 10 12; U10 15; U13 15; U20 7 9; U21 1 2 3 4 5 6 7 8 9 10 11 12 13; U23 6 8 11; U25 1 2 3 4 5 6 7 8 9 10 11 12 13 14 15 16 17 18 19 20 21 22 23 24 25 26 27 28 29 30 31 32 33 34 35 36 37 38
